# EAGLE design utilidong-septic-sepic-lt1610-mk-1.0 (EAGLE 6.5.0)
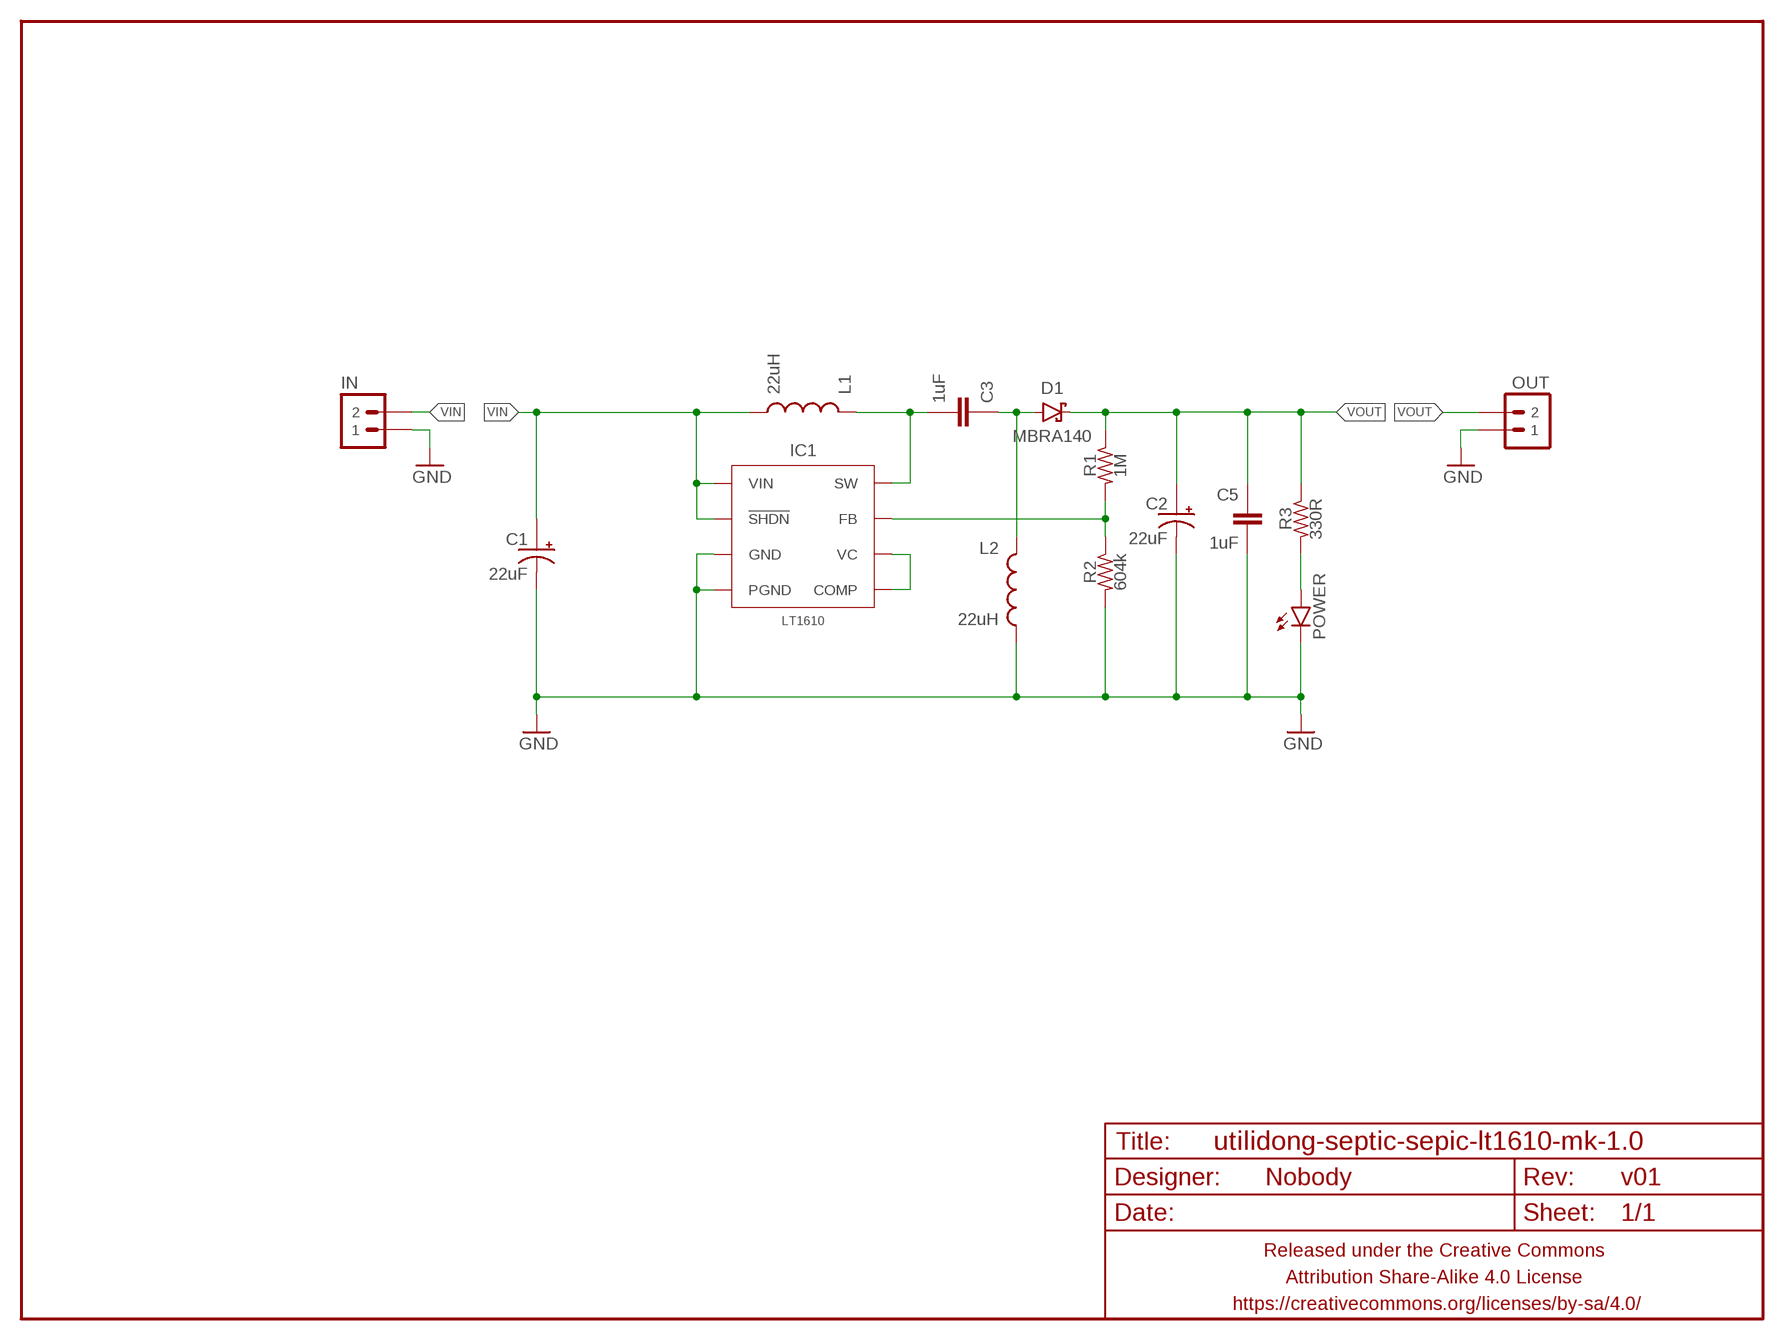
[diagram p0: schematic, sheet 1]

## Parts
C1  22uF  CAPACITOR-POLARIZEDE2.5-6  [E2,5-6]
C2  22uF  CAPACITOR-POLARIZEDE2.5-6  [E2,5-6]
C3  1uF  CAPACITOR-CERAMICC0805  [C0805]
C5  1uF  CAPACITOR-CERAMICC0805  [C0805]
D1  MBRA140  DIODE-SCHOTTKYSMA  [SMA-DIODE-SCHOTTKY]
FRAME1  FRAME-LETTERNO_PACKAGE  [DUMMY]
IC1  LT1610  LT1610SOICN8  [SO08]
IN  M02PTH-CENTERED-R+  [1X02-CENTER-R+]
L1  22uH  INDUCTORTAIYO-YUDEN-40XX  [TAIYO-YUDEN-40XX]
L2  22uH  INDUCTORTAIYO-YUDEN-40XX  [TAIYO-YUDEN-40XX]
OUT  M02PTH-CENTERED-R+  [1X02-CENTER-R+]
POWER  LED1206  [LED-1206]
R1  1M  RESISTORR0805  [R0805]
R2  604k  RESISTORR0805  [R0805]
R3  330R  RESISTORR0805  [R0805]

## Nets
GND: C1.- C2.- C5.2 IC1.4(PGND) IC1.7(GND) IN.1 L2.2 OUT.1 POWER.C R2.2
N$1: POWER.A R3.2
N$2: C3.2 IC1.5(SW) L1.1
N$4: IC1.1(VC) IC1.8(COMP)
N$5: C3.1 D1.A L2.1
N$7: IC1.2(FB) R1.2 R2.1
VIN: C1.+ IC1.3(!SHDN) IC1.6(VIN) IN.2 L1.2
VOUT: C2.+ C5.1 D1.C OUT.2 R1.1 R3.1

## Library data of the parts
C1 C2 = A_butts:CAPACITOR-POLARIZED: POLARIZED CAPACITOR, American symbol
C3 C5 = A_butts:CAPACITOR-CERAMIC: CAPACITOR, European symbol
D1 = A_butts:DIODE-SCHOTTKY: Schottky diodes in SFE's production catalog BAT20J 1A 23V 0.62Vf RB751 120mA 40V 0.37Vf PMEG4005EJ 0.5A 40V 0.42Vf MBRA140 1A 40V 0.5Vf B340A 3A 40V SMA
FRAME1 = A_butts:FRAME-LETTER: Schematic Frame Standard 8.5x11 US Letter frame; DESIGNER: Nobody; VERSION: v01
IC1 = A_butts:LT1610
IN OUT = A_butts:M02: Standard 2-pin 0.1" header. Use with - straight break away headers ( PRT-00116) - right angle break away headers (PRT-00553) - swiss pins (PRT-00743) - machine pins (PRT-00117) - female headers (PRT-00115) Molex polarized connector foot print use with: PRT-08233 with associated crimp pins and housings. 2.54_SCREWTERM for use with PRT-10571. 3.5mm Screw Terminal footprints for PRT-08084 5mm Screw Terminal footprints for use with PRT-08433
L1 L2 = A_butts:INDUCTOR: Inductors Basic Inductor/Choke - 0603 and 1206. Footprints are not proven and vary greatly between part numbers. SRN6045- 33uH, 20% 1.4A SDR0403-560KL - 56uH, 10%, 500mA RMS/740mA peak
POWER = A_butts:LED: LEDs Standard schematic elements and footprints for 5mm, 3mm, 1206, and 0603 sized LEDs. 5mm - Spark Fun Electronics SKU : COM-00529 (and others)
R1-R3 = A_butts:RESISTOR: RESISTOR, American symbol

## Board
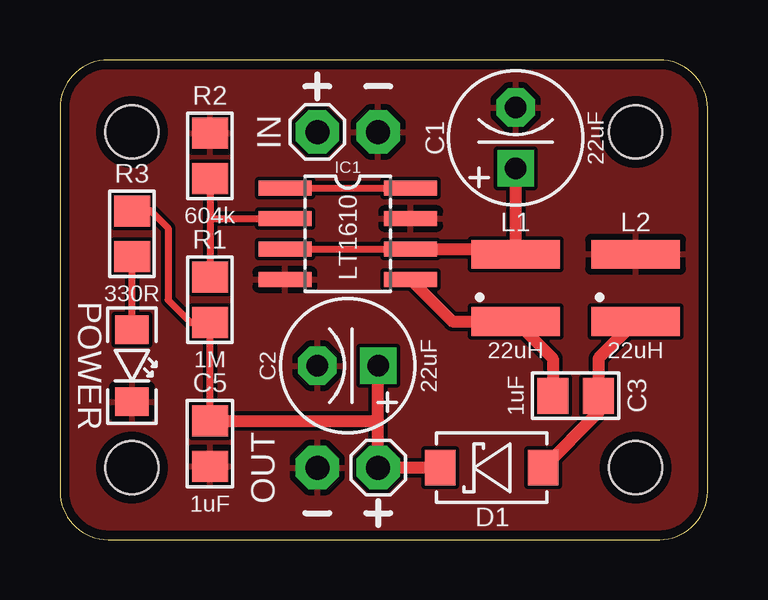
[diagram p1: board, top side]
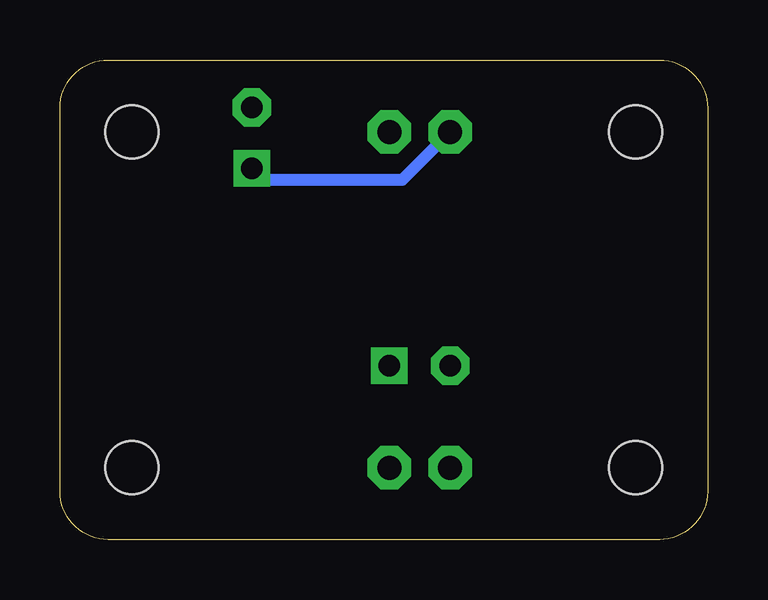
[diagram p2: board, bottom side, seen from below]

Size 27 x 20 mm. Coordinates in mm from the lower left corner, seen from the top.
Outline: 0,18 0,2 arc90 2,0 25,0 arc90 27,2 27,18 arc90 25,20 2,20 arc90 0,18
Copper layers (1*16): Top 0.0356mm / dielectric 1.5011mm / Bottom 0.0356mm
Design rules "LaenPCBOrder_2": minimum track width 6mil, minimum drill 13mil, track to track 6mil, track to pad 6mil, pad to pad 6mil, via to via 6mil, smd to smd 6mil, copper to edge 15mil, drill to drill 6mil, minimum pad ring 7mil, minimum via ring 7mil, stop-mask expansion 3mil, vias tented up to drill 20mil, thermal gap 10mil
Holes 2.2 mm at 3,3 3,17 24,17 24,3

### Footprints (pad centres in the part's own frame; a part is rotated, then mirrored left to right if it is on the bottom)
E2,5-6 = drill 0.9 pad 1.524 square: + -1.27,0 | drill 0.9 pad 1.6 octagon: - 1.27,0
C0805 = smd 1.3 x 1.5: 1 -0.95,0; 2 0.95,0
SMA-DIODE-SCHOTTKY = smd 1.27 x 1.47: A -2.15,0; C 2.15,0
SO08 = smd 0.61 x 2.21: 1 -1.905,-2.616; 2 -0.635,-2.616; 3 0.635,-2.616; 4 1.905,-2.616; 5 1.905,2.616; 6 0.635,2.616; 7 -0.635,2.616; 8 -1.905,2.616
1X02-CENTER-R+ = drill 1 pad 1.8 octagon: 1 -1.27,0; 2 1.27,0
TAIYO-YUDEN-40XX = smd 1.2 x 3.7: 1 -1.4,0; 2 1.4,0
LED-1206 = smd 1.2 x 1.4: A -1.5,0; C 1.5,0
R0805 = smd 1.3 x 1.5: 1 -0.95,0; 2 0.95,0

### Placement (x,y rotation side)
C1  19,16.75 90 top
C2  12,7.25 180 top
C3  21.5,6 180 top
C5  6.25,4 270 top
D1  18,3 180 top
FRAME1  0,0 0 top
IC1  12,12.75 270 top
IN  12,17 180 top
L1  19,10.5 90 top
L2  24,10.5 90 top
OUT  12,3 0 top
POWER  3,7.25 270 top
R1  6.25,10 90 top
R2  6.25,16 90 top
R3  3,12.75 270 top

### Tracks (layer width: path | path; a pad name or v marks a point on that pad's centre or on a via)
GND
  pour Top: -0.1,-0.1 -0.1,20.1 27.1,20.1 27.1,-0.1
N$1
  Top 0.3: POWER.A R3.2
N$2
  Top 0.5: IC1.5 16.36,9.1 L1.1 20.55,7.55 C3.2
N$4
  Top 0.3: IC1.1 IC1.8
N$5
  Top 0.5: D1.A 22.45,5.3 C3.1 22.45,7.55 L2.1
N$7
  Top 0.3: R2.1 6.25,13.38 | 6.25,13.38 IC1.2 | 6.25,13.38 R1.2
VIN
  Top 0.3: IC1.3 IC1.6
  Top 0.5: C1.+ L1.2 18.79,12.12 IC1.6
  Bottom 0.5: IN.2 12.73,15 18.52,15 C1.+
VOUT
  Top 0.3: R3.1 3.8,13.7 4.5,13 4.5,10 5.45,9.05 R1.1 C5.1
  Top 0.5: D1.C OUT.2 13.27,4.95 | C5.1 13.27,4.95 | 13.27,4.95 C2.+